# Altium schematic sheet Gero_Block Diagram.SchDoc: P.C. BOARD
size B; Organization: EmbDes; DocumentNumber: 1; Revision: A; SheetNumber: 1; SheetTotal: 3; PageSetup: Record=PageOptions|CenterHorizontal=True|CenterVertical=True|PrintScale=1.35|XCorrection=1.00|YCorrection=1.00|PrintKind=2|BorderSize=5000000|LeftOffset=0|BottomOffset=0|Orientation=2|PaperLength=1000|PaperWidth=1000|Scale=100|PaperSource=7|PrintQuality=-4|MediaType=1|DitherType=10|PaperKind=Letter (8.5 x 11")|PrintScaleMode=1
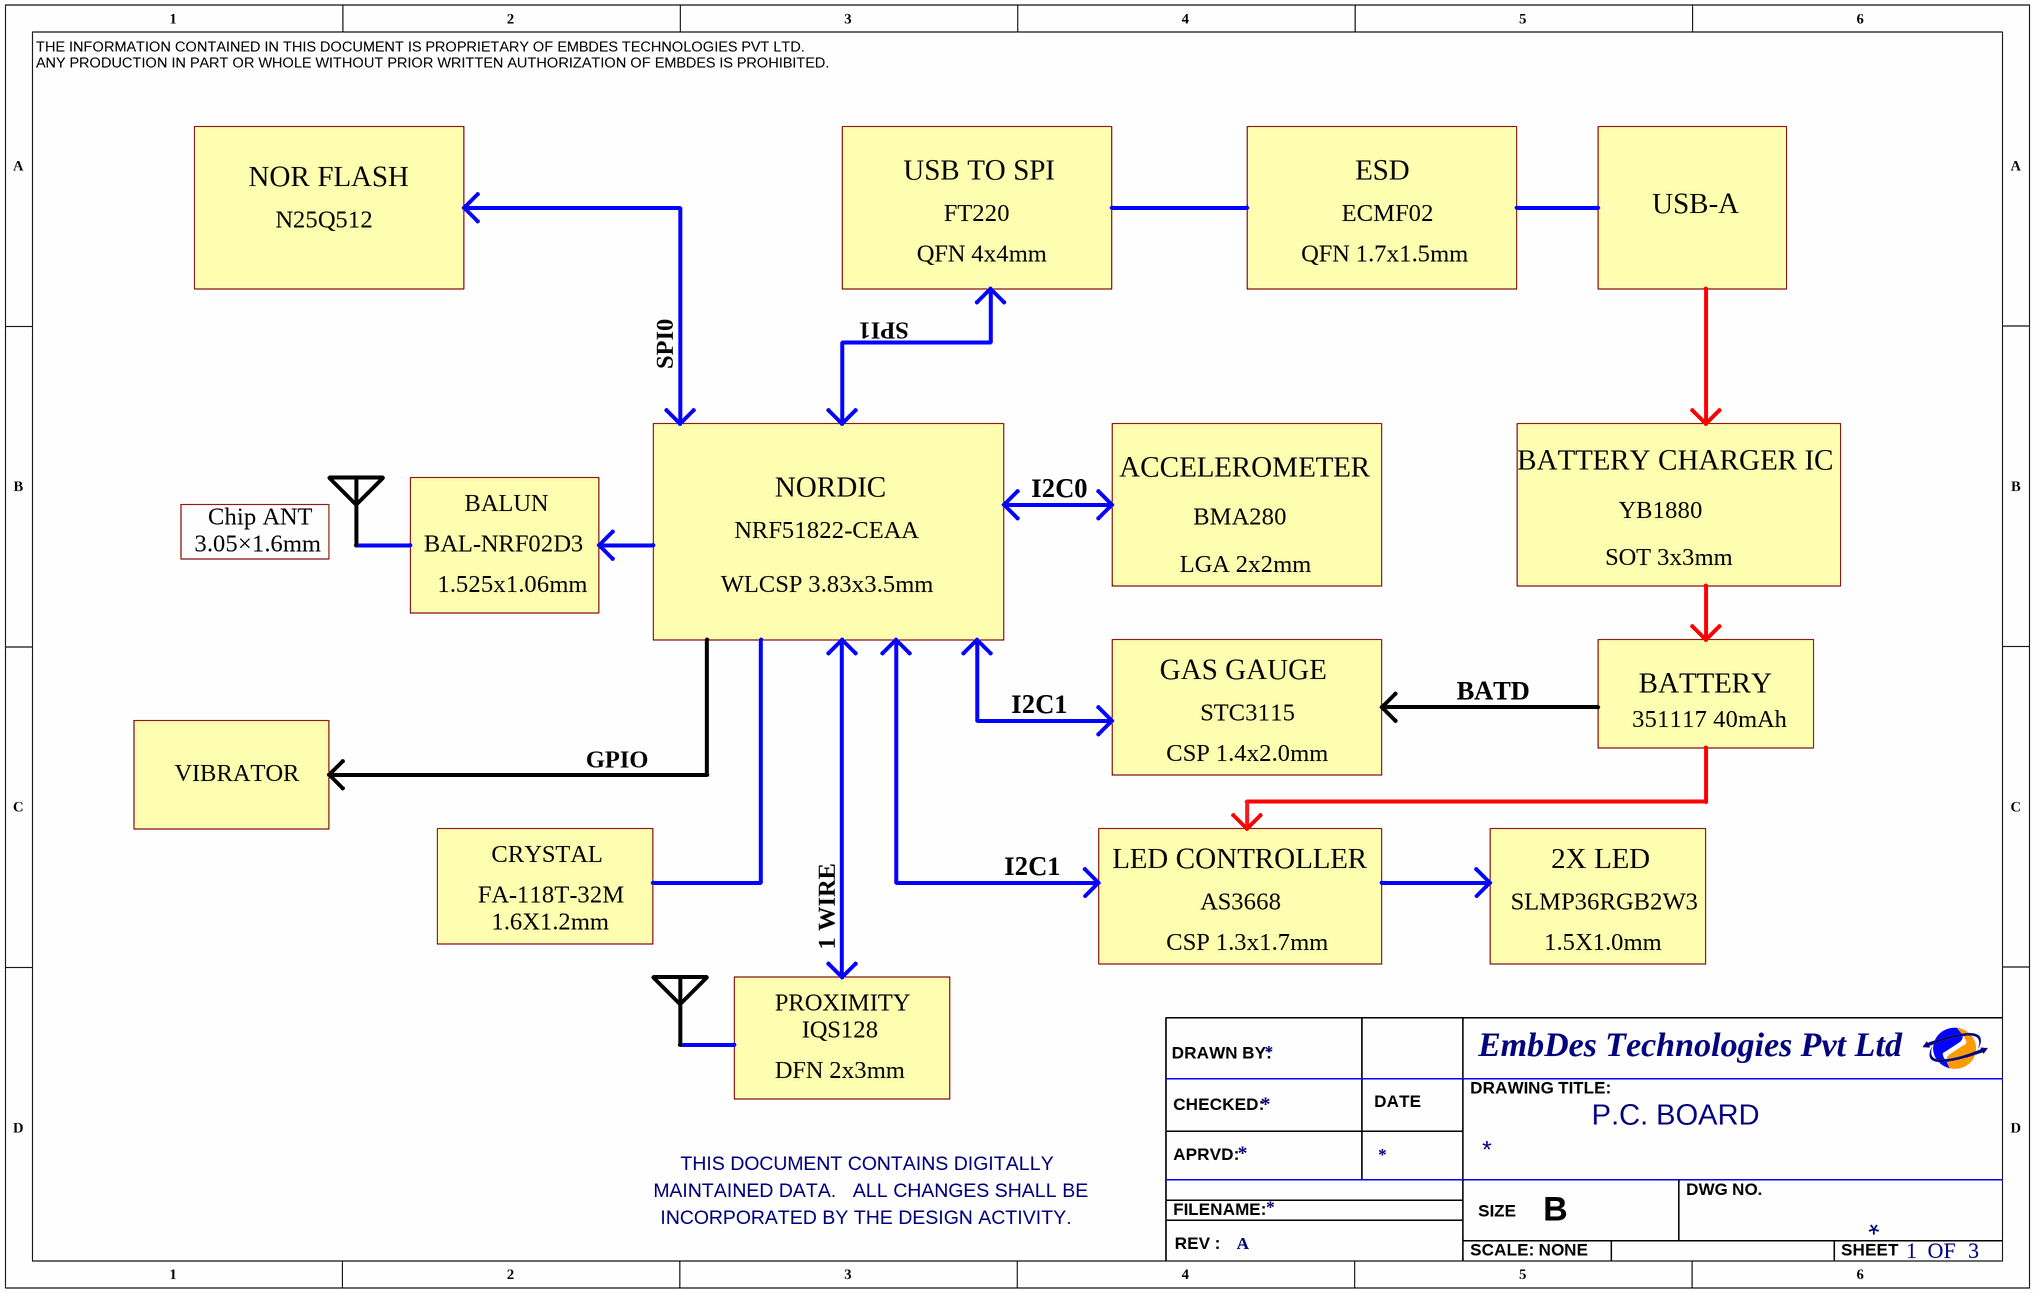
[diagram p0: Gero_Block Diagram.SchDoc]

## Notes on the sheet
- NOR FLASH
- N25Q512
- USB TO SPI
- FT220
- ECMF02
- ESD
- USB-A
- QFN 4x4mm
- QFN 1.7x1.5mm
- SPI0
- SPI1
- NORDIC
- I2C0
- ACCELEROMETER
- BATTERY CHARGER IC
- 3.05×1.6mm
- Chip ANT
- BAL-NRF02D3
- BALUN
- NRF51822-CEAA
- BMA280
- SOT 3x3mm
- YB1880
- 1.525x1.06mm
- WLCSP 3.83x3.5mm
- LGA 2x2mm
- GAS GAUGE
- BATD
- BATTERY
- GPIO
- I2C1
- CSP 1.4x2.0mm
- STC3115
- 351117 40mAh
- VIBRATOR
- FA-118T-32M
- CRYSTAL
- LED CONTROLLER
- AS3668
- SLMP36RGB2W3
- 2X LED
- 1.6X1.2mm
- 1 WIRE
- CSP 1.3x1.7mm
- 1.5X1.0mm
- PROXIMITY
- IQS128
- DFN 2x3mm
- THE INFORMATION CONTAINED IN THIS DOCUMENT IS PROPRIETARY OF EMBDES TECHNOLOGIES PVT LTD.
  ANY PRODUCTION IN PART OR WHOLE WITHOUT PRIOR WRITTEN AUTHORIZATION OF EMBDES IS PROHIBITED.
- DRAWN BY:
- CHECKED:
- DATE
- DRAWING TITLE:
- EmbDes Technologies Pvt Ltd
- THIS DOCUMENT CONTAINS DIGITALLY
- APRVD:
- MAINTAINED DATA.   ALL CHANGES SHALL BE
- INCORPORATED BY THE DESIGN ACTIVITY.
- FILENAME:
- SIZE
- B
- DWG NO.
- REV :
- SCALE: NONE
- SHEET
- OF